# Altium schematic sheet radio_frequency.SchDoc
size A4; DrawnBy: Van Tuan Ngo; Organization: PIF Club; Address1: 304B1, HCMUT,; Address2: Ly Thuong Kiet St.,; Address3: District 10, HCM, VN; DocumentNumber: 7; Revision: 1.0.0; SheetNumber: 7; SheetTotal: 8; Project: PIFWRobot
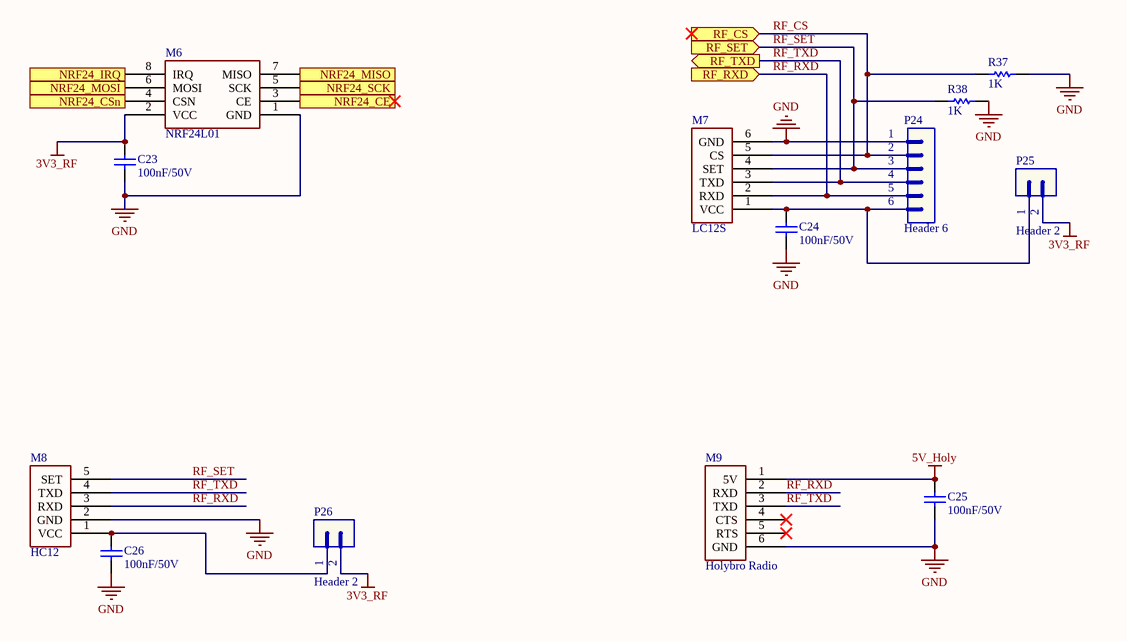
[diagram p0: radio_frequency.SchDoc]

## Parts
C23  value 100nF/50V  [CAP-SM-0805]  (hidden comment: Cap-100nF-50V-0805)
C24  value 100nF/50V  [CAP-SM-0805]  (hidden comment: Cap-100nF-50V-0805)
C25  value 100nF/50V  [CAP-SM-0805]  (hidden comment: Cap-100nF-50V-0805)
C26  value 100nF/50V  [CAP-SM-0805]  (hidden comment: Cap-100nF-50V-0805)
M6  NRF24L01  [NRF24L01]
M7  LC12S  [LC12S]
M8  HC12  [HC12]
M9  Holybro Radio  [HOLYBRO-RADIO]
P24  Header 6  [JP6]
P25  Header 2  [JP2]
P26  Header 2  [JP2]
R37  value 1K  [RES-SM-0805]  (hidden comment: Res-1K-0805)
R38  value 1K  [RES-SM-0805]  (hidden comment: Res-1K-0805)

## Ports
NRF24_CE (in), NRF24_CSn (in), NRF24_IRQ (out), NRF24_MISO (out), NRF24_MOSI (in), NRF24_SCK (in), RF_CS (in), RF_RXD (in), RF_SET (in), RF_TXD (out)

## Nets
3V3_RF: C23.2 M6.2(VCC) P25.2 P26.2
5V_Holy: C25.2 M9.1(5V)
GND: C23.1 C24.1 C25.1 C26.1 M6.1(GND) M7.6(GND) M8.2(GND) M9.6(GND) P24.1 R37.2 R38.2
NRF24_CE: M6.3(CE) ; port NRF24_CE
NRF24_CSn: M6.4(CSN) ; port NRF24_CSn
NRF24_IRQ: M6.8(IRQ) ; port NRF24_IRQ
NRF24_MISO: M6.7(MISO) ; port NRF24_MISO
NRF24_MOSI: M6.6(MOSI) ; port NRF24_MOSI
NRF24_SCK: M6.5(SCK) ; port NRF24_SCK
RF_CS: M7.5(CS) P24.2 R37.1 ; port RF_CS
RF_RXD: M7.2(RXD) M8.3(RXD) M9.2(RXD) P24.5 ; port RF_RXD
RF_SET: M7.4(SET) M8.5(SET) P24.3 R38.1 ; port RF_SET
RF_TXD: M7.3(TXD) M8.4(TXD) M9.3(TXD) P24.4 ; port RF_TXD
NetC24_2: C24.2 M7.1(VCC) P24.6 P25.1
NetC26_2: C26.2 M8.1(VCC) P26.1

Not connected (* = marked no-connect by the designer): M9 4(CTS)* 5(RTS)*

## Notes on the sheet
- Project
- Revision
- Date
- Author
- Sheet
- Time
- of
- File

## Library data of the parts
C23-C26 = Cap-100nF-50V-0805: CAP CER 0.1UF 50V Y5V 0805; Manufacturer: Samsung Electro-Mechanics; Manufacturer Part Number: CL21F104ZBCNNNC; Local Supplier: thegioiic; Local Supplier Link: https://thegioiic.com/products/tu-100nf-0-1uf-50v-0805; Supplier 1: Digikey; Supplier 1 Part Number: 1276-1007-1-ND; Supplier 1 Link: https://www.digikey.com/product-detail/en/samsung-electro-mechanics/CL21F104ZBCNNNC/1276-1007-1-ND/3889093
P24 = Header 6: Header, 6-Pin; LatestRevisionDate: 17-Jul-2002; LatestRevisionNote: Re-released for DXP Platform.; Publisher: Altium Limited; Local Supplier Link: https://www.thegioiic.com/products/hang-rao-duc-don-2-54mm-40-chan-1-hang-cao-11-4mm-xuyen-lo; Local Supplier: thegioiic; Local Supplier Part Number: x
P25 P26 = Header 2: Header, 2-Pin; LatestRevisionDate: 17-Jul-2002; LatestRevisionNote: Re-released for DXP Platform.; Publisher: Altium Limited; Local Supplier: thegioiic; Local Supplier Part Number: x; Local Supplier Link: https://www.thegioiic.com/products/hang-rao-duc-don-2-54mm-40-chan-1-hang-cao-11-4mm-xuyen-lo
R37 R38 = Res-1K-0805: RES 1K OHM 1% 1/4W 0805; Manufacturer: Stackpole Electronics Inc; Manufacturer Part Number: RNCP0805FTD1K00; Local Supplier: thegioiic; Local Supplier Link: https://www.thegioiic.com/products/dien-tro-1-kohm-0805-5; Supplier 1: Digikey; Supplier 1 Link: https://www.digikey.com/product-detail/en/stackpole-electronics-inc/RNCP0805FTD1K00/RNCP0805FTD1K00CT-ND/2240568; Supplier 1 Part Number: RNCP0805FTD1K00CT-ND
M6 = NRF24L01: Local Supplier: thegioiic; Local Supplier Part Number: *; Manufacturer: *; Manufactuere Part Number: *; Local Supplier Link: https://www.thegioiic.com/products/nrf24l01-pa-lna-thu-phat-rf-2-4ghz-1000m
M7 = LC12S: Manufacturer: *; Manufacturer Part Number: *; Local Supplier: thegioiic; Local Supplier Link: https://www.thegioiic.com/products/lc12s-mach-thu-phat-rf-2-4ghz-uart-128-kenh-120m; Local Supplier Part Number: *
M8 = HC12: Manufacturer: *; Manufacturer Part Number: *; Local Supplier: thegioiic; Local Supplier Link: https://www.thegioiic.com/products/hc-12-si4463-mach-thu-phat-rf-433mhz-1000m; Local Supplier Part Number: *
M9 = Holybro Radio: Supplier: *; Supplier Part Number: *; Manufacturer: *; Manufacturer Part Number: *; Supplier Link: https://www.lazada.vn/products/ld-holybro-433mhz-915-mhz-500-mw-thu-phat-vo-tuyen-xa-bo-v3-cho-pixhawk-4-dieu-khien-chuyen-bay-i430804435-s768474304.html?spm=a2o4n.searchlist.list.4.25396b19yIS9XO&search=1; Local Supplier: x; Local Supplier Part Number: x; Local Supplier Link: x